# Altium schematic sheet Sheet2.SchDoc
size A; SheetNumber: 2; SheetTotal: 2
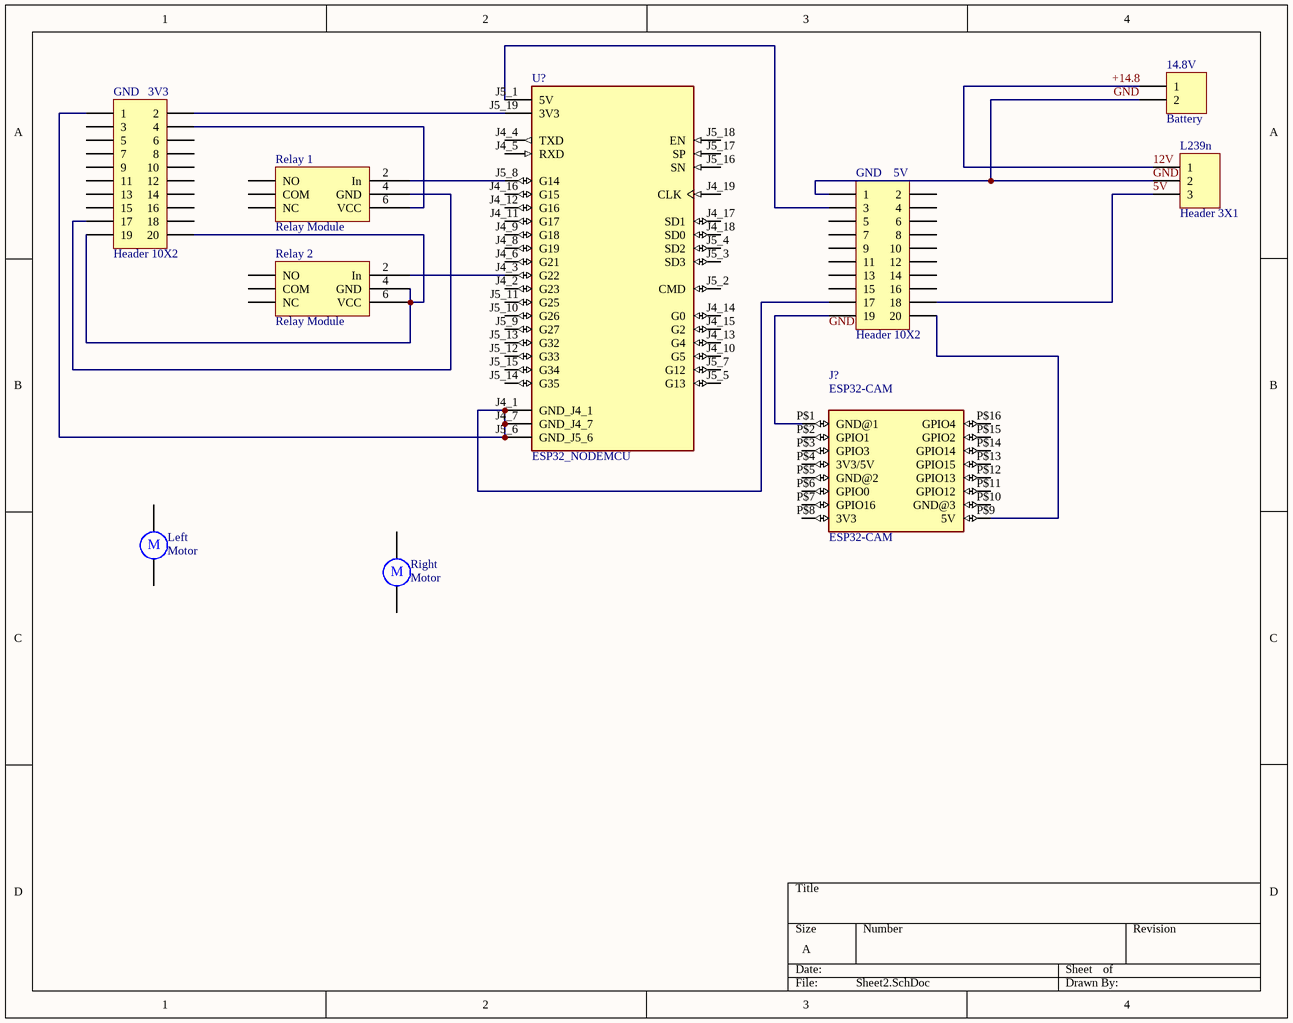
[diagram p0: Sheet2.SchDoc]

## Parts
14.8V  Battery  [HDR1X2_R]
GND_3V3  Header 10X2  [HDR2X10]
GND_5V  Header 10X2  [HDR2X10]
J?  ESP32-CAM  [ESP32-CAM]
L239n  Header 3X1  [HDR1X3]
Left  Motor  [RB5-10.5]
Relay_1  Relay Module  [HDR3X2]
Relay_2  Relay Module  [HDR3X2]
Right  Motor  [RB5-10.5]
U?  ESP32_NODEMCU  [MODULE_ESP32_NODEMCU]

## Nets
5V: GND_5V.18 L239n.3
+14.8: 14.8V.1 L239n.1  [also labelled 12V]
GND: 14.8V.2 GND_5V.1 L239n.2
NetGND_3V3_1: GND_3V3.1 GND_5V.17 U?.J4_1(GND_J4_1) U?.J4_7(GND_J4_7) U?.J5_6(GND_J5_6)
NetGND_3V3_2: GND_3V3.2 U?.J5_19(3V3)
NetGND_3V3_4: GND_3V3.4 Relay_1.6(VCC)
NetGND_3V3_17: GND_3V3.17 Relay_1.4(GND)
NetGND_3V3_19: GND_3V3.19 GND_3V3.20 Relay_2.4(GND) Relay_2.6(VCC)
NetGND_5V_3: GND_5V.3 U?.J5_1(5V)
NetGND_5V_19: GND_5V.19 J?.P$1(GND@1)
NetGND_5V_20: GND_5V.20 J?.P$9(5V)
NetRelay_1_2: Relay_1.2(In) U?.J5_8(G14)
NetRelay_2_2: Relay_2.2(In) U?.J4_3(G22)

Not connected (* = marked no-connect by the designer): GND_3V3 3 5 6 7 8 9 10 11 12 13 14 15 16 18; GND_5V 2 4 5 6 7 8 9 10 11 12 13 14 15 16; J? P$2(GPIO1) P$3(GPIO3) P$4(3V3/5V) P$5(GND@2) P$6(GPIO0) P$7(GPIO16) P$8(3V3) P$10(GND@3) P$11(GPIO12) P$12(GPIO13) P$13(GPIO15) P$14(GPIO14) P$15(GPIO2) P$16(GPIO4); Left 1 2; Relay_1 1(NO) 3(COM) 5(NC); Relay_2 1(NO) 3(COM) 5(NC); Right 1 2; U? J4_2(G23) J4_4(TXD) J4_5(RXD) J4_6(G21) J4_8(G19) J4_9(G18) J4_10(G5) J4_11(G17) J4_12(G16) J4_13(G4) J4_14(G0) J4_15(G2) J4_16(G15) J4_17(SD1) J4_18(SD0) J4_19(CLK) J5_2(CMD) J5_3(SD3) J5_4(SD2) J5_5(G13) J5_7(G12) J5_9(G27) J5_10(G26) J5_11(G25) J5_12(G33) J5_13(G32) J5_14(G35) J5_15(G34) J5_16(SN) J5_17(SP) J5_18(EN)

## Notes on the sheet
- Labels drawn without touching a wire or pin: GND
- (in symbol Motor) M

## Library data of the parts
14.8V = Socket_2X1: SOCKET 2POS .100" SINGL TIN; LatestRevisionDate: 17-Jul-2002; LatestRevisionNote: Re-released for DXP Platform.; Publisher: Altium Limited; Supplier 1: Digi-Key; Supplier Part Number 1: ED11155-ND; Value: Battery
GND_3V3 GND_5V = Header 10X2: Header, 10-Pin, Dual row; LatestRevisionDate: 17-Jul-2002; LatestRevisionNote: Re-released for DXP Platform.; Publisher: Altium Limited
J? = ESP32-CAM: ESP32 ESP32 Transceiver; 802.11 a/b/g/n (Wi-Fi, WiFi, WLAN), BluetoothÂ® Smart 4.x Low Energy (BLE) Evaluation Board; MF: AI-Thinker; SnapEDA_Link: https://www.snapeda.com/parts/ESP32-CAM/AI-Thinker/view-part/?ref=snap; Package: None; Value: *; MP: ESP32-CAM; Check_prices: https://www.snapeda.com/parts/ESP32-CAM/AI-Thinker/view-part/?ref=eda
L239n = Header 3X1: CONN HEADER 3POS .100" SINGL TIN; LatestRevisionDate: 17-Jul-2002; LatestRevisionNote: Re-released for DXP Platform.; Publisher: Altium Limited; Supplier 1: Digi-Key; Supplier Part Number 1: SAM1035-03-ND; Value: Header 3X1
Left Right = Motor: Motor, General Kind; Published: 24-Mar-1999; LatestRevisionDate: 17-Jul-2002; LatestRevisionNote: Re-released for DXP Platform.; PackageReference: RB5-10.5; Publisher: Altium Limited; PackageDescription: Capacitor (Radial); 2 Leads
Relay_1 Relay_2 = Relay: CONN HEADER 3POS .100" SINGL TIN; LatestRevisionDate: 17-Jul-2002; LatestRevisionNote: Re-released for DXP Platform.; Publisher: Altium Limited; Supplier 1: Digi-Key; Supplier Part Number 1: SAM1035-03-ND; Value: Relay Module
U? = ESP32_NODEMCU: NodeMCU is an open source loT platform. ESP32 is a series of low cost, low powersystem-on-chip (SoC) microcontrollers with integrated Wi-Fi & dual-mode Bluetooth.; MP: ESP32 NodeMCU; MF: Espressif Systems; Package: Package; SnapEDA_Link: https://www.snapeda.com/parts/ESP32%20NodeMCU/Espressif+Systems/view-part/?ref=snap; Availability: Not in stock; Value: *; Check_prices: https://www.snapeda.com/parts/ESP32%20NodeMCU/Espressif+Systems/view-part/?ref=eda; Price: None